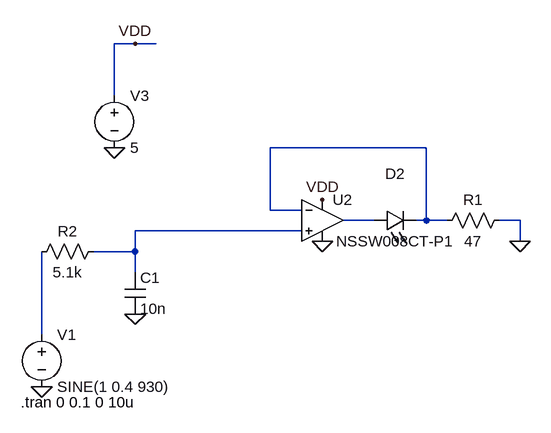
[diagram p0: schematic LEDCircuit.asc]
LEDCircuit.asc, the LTspice schematic file:
Version 4
SHEET 1 880 680
WIRE -128 -368 -160 -368
WIRE -96 -368 -128 -368
WIRE -160 -288 -160 -368
WIRE 320 -208 80 -208
WIRE 80 -112 80 -208
WIRE 128 -112 80 -112
WIRE 240 -96 192 -96
WIRE 320 -96 320 -208
WIRE 320 -96 304 -96
WIRE 352 -96 320 -96
WIRE 464 -96 432 -96
WIRE 128 -80 -128 -80
WIRE 464 -64 464 -96
WIRE -128 -48 -128 -80
WIRE -128 -48 -192 -48
WIRE -128 -16 -128 -48
WIRE -272 80 -272 -48
FLAG -272 160 0
FLAG -160 -208 0
FLAG -128 -368 VDD
FLAG 160 -128 VDD
FLAG 160 -64 0
FLAG 464 -64 0
FLAG -128 48 0
SYMBOL voltage -272 64 R0
WINDOW 123 0 0 Left 0
WINDOW 39 0 0 Left 0
SYMATTR InstName V1
SYMATTR Value SINE(1 0.4 930)
SYMBOL voltage -160 -304 R0
SYMATTR InstName V3
SYMATTR Value 5
SYMBOL OpAmps\\UniversalOpAmp 160 -96 R0
SYMATTR InstName U2
SYMBOL LED 240 -80 R270
WINDOW 0 72 32 VTop 2
WINDOW 3 0 32 VBottom 2
SYMATTR InstName D2
SYMATTR Value NSSW008CT-P1
SYMATTR Description Diode
SYMATTR Type diode
SYMBOL res 448 -112 R90
WINDOW 0 0 56 VBottom 2
WINDOW 3 32 56 VTop 2
SYMATTR InstName R1
SYMATTR Value 47
SYMBOL res -176 -64 R90
WINDOW 0 0 56 VBottom 2
WINDOW 3 32 56 VTop 2
SYMATTR InstName R2
SYMATTR Value 5.1k
SYMBOL cap -144 -16 R0
SYMATTR InstName C1
SYMATTR Value 10n
TEXT -304 184 Left 2 !.tran 0 0.1 0 10u

The netlist it stands for:
* LEDCircuit.asc
V1 N004 0 SINE(1 0.4 930)
V3 VDD 0 5
XU2 N003 N001 VDD 0 N002 level1 Avol=1Meg GBW=10Meg Vos=0 En=0 Enk=0 In=0 Ink=0 Rin=500Meg  ; pins In+ In- V+ V- OUT
D2 N002 N001 NSSW008CT-P1
R1 0 N001 47
R2 N003 N004 5.1k
C1 N003 0 10n
.model D D
.lib standard.dio
.tran 0 0.1 0 10u
.lib UniversalOpAmp1.lib
.backanno
.end